# EAGLE design CycleOpsPro300toANTPlus_V2.0 (EAGLE 7.5.0)
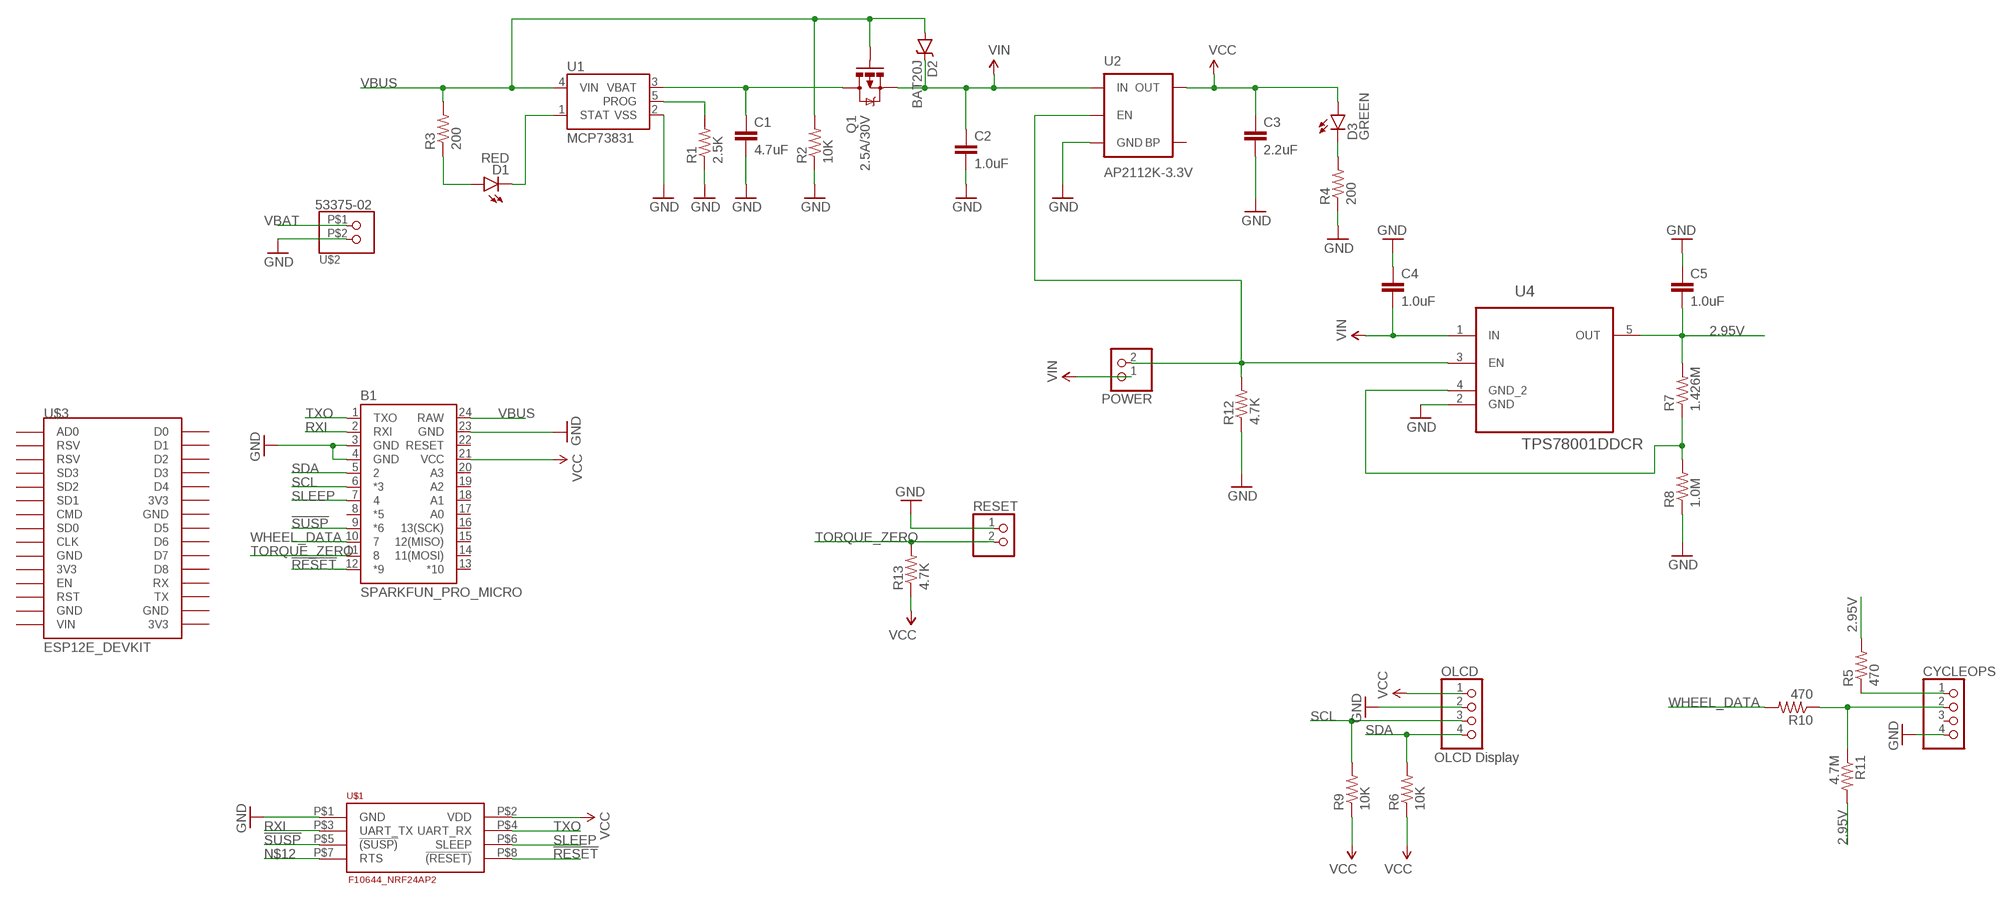
[diagram p0: schematic, sheet 1]

## Parts
B1  SPARKFUN_PRO_MICRO  [SPARKFUN_PRO_MICRO]
C1  4.7uF  CAP0603-CAP  [0603-CAP]
C2  1.0uF  CAP0603-CAP  [0603-CAP]
C3  2.2uF  CAP0603-CAP  [0603-CAP]
C4  1.0uF  CAP0603-CAP  [0603-CAP]
C5  1.0uF  CAP0603-CAP  [0603-CAP]
CYCLEOPS  PINHD-1X4  [1X04]
D1  RED  LED0603  [LED-0603]
D2  BAT20J  DIODE-SCHOTTKY-BAT20J  [SOD-323]
D3  GREEN  LED0603  [LED-0603]
OLCD  PINHD-1X4  [1X04]
POWER  PINHD-1X2  [1X02]
Q1  2.5A/30V  MOSFET-PCHANNELDMG2307L  [SOT23-3]
R1  2.5K  RESISTOR0603-RES  [0603-RES]
R2  10K  RESISTOR0603-RES  [0603-RES]
R3  200  RESISTOR0603-RES  [0603-RES]
R4  200  RESISTOR0603-RES  [0603-RES]
R5  470  RESISTOR0603-RES  [0603-RES]
R6  10K  RESISTOR0603-RES  [0603-RES]
R7  1.426M  RESISTOR0603-RES  [0603-RES]
R8  1.0M  RESISTOR0603-RES  [0603-RES]
R9  10K  RESISTOR0603-RES  [0603-RES]
R10  470  RESISTOR0603-RES  [0603-RES]
R11  4.7M  RESISTOR0603-RES  [0603-RES]
R12  4.7K  RESISTOR0603-RES  [0603-RES]
R13  4.7K  RESISTOR0603-RES  [0603-RES]
RESET  PINHD-1X2  [1X02]
U1  MCP73831  [SOT23-5]
U2  AP2112K-3.3V  V_REG_LDOSMD  [SOT23-5]
U4  TPS78001DDCR  TPS78223DDCR  [SOT95P280X110-5N]
U$1  F10644_NRF24AP2  [F10644_NRF24AP2]
U$2  53375-02  [53375-02]
U$3  ESP12E_DEVKIT  [ESP12E_DEVKIT]

## Nets
2.95V: C5.2 R5.2 R7.2 R11.2 U4.5(OUT)
!RESET: B1.12(*9) U$1.P$8(!(RESET))
!SUSP: B1.9(*6) U$1.P$5(!(SUSP))
GND: B1.3(GND) B1.4(GND) B1.23(GND) C1.2 C2.2 C3.2 C4.1 C5.1 CYCLEOPS.4 OLCD.2 R1.1 R2.1 R4.1 R8.1 R12.1 RESET.1 U1.2(VSS) U2.2(GND) U4.2(GND) U$1.P$1(GND) U$2.P$2
N$1: D1.A R3.1
N$2: D1.C U1.1(STAT)
N$3: CYCLEOPS.1 R5.1
N$4: R1.2 U1.5(PROG)
N$5: CYCLEOPS.2 R10.1 R11.1
N$6: D3.C R4.2
N$8: POWER.2 R12.2 U2.3(EN) U4.3(EN)
N$9: R7.1 R8.2 U4.4(GND_2)
N$12: U$1.P$7(RTS)
RXI: B1.2(RXI) U$1.P$3(UART_TX)
SCL: B1.6(*3) OLCD.3 R9.2
SDA: B1.5 OLCD.4 R6.2
SLEEP: B1.7 U$1.P$6(SLEEP)
TORQUE_ZERO: B1.11 R13.2 RESET.2
TXO: B1.1(TXO) U$1.P$4(UART_RX)
VBAT: C1.1 Q1.3(D) U1.3(VBAT) U$2.P$1
VBUS: B1.24(RAW) D2.A Q1.1(G) R2.2 R3.2 U1.4(VIN)
VCC: B1.21(VCC) C3.1 D3.A OLCD.1 R6.1 R9.1 R13.1 U2.5(OUT) U$1.P$2(VDD)
VIN: C2.1 C4.2 D2.C POWER.1 Q1.2(S) U2.1(IN) U4.1(IN)
WHEEL_DATA: B1.10 R10.2
Unconnected: B1.8(*5) B1.13(*10) B1.14(11(MOSI)) B1.15(12(MISO)) B1.16(13(SCK)) B1.17(A0) B1.18(A1) B1.19(A2) B1.20(A3) B1.22(RESET) CYCLEOPS.3 U2.4(BP) U$3.3V3@0(3V3) U$3.3V3@1(3V3) U$3.3V3@2(3V3) U$3.AD0 U$3.CLK U$3.CMD U$3.D0 U$3.D1 U$3.D2 U$3.D3 U$3.D4 U$3.D5 U$3.D6 U$3.D7 U$3.D8 U$3.EN U$3.GND@0(GND) U$3.GND@1(GND) U$3.GND@2(GND) U$3.GND@3(GND) U$3.RST U$3.RSV@0(RSV) U$3.RSV@1(RSV) U$3.RX U$3.SD0 U$3.SD1 U$3.SD2 U$3.SD3 U$3.TX U$3.VIN

## Notes on the sheet
- OLCD Display

## Library data of the parts
B1 = SparkFun-Boards:SPARKFUN_PRO_MICRO: SparkFun Pro Micro Atmega32U4 compatible footprint. SparkFun Products: 3.3V/8MHz <https://www.sparkfun.com/products/12587> 5V/16MHz <https://www.sparkfun.com/products/12640>
C1-C5 = SparkFun-Passives:CAP: Capacitor Standard 0603 ceramic capacitor, and 0.1" leaded capacitor.
CYCLEOPS OLCD = pinhead:PINHD-1X4: PIN HEADER
D1 D3 = SparkFun-LED:LED: LEDs Standard schematic elements and footprints for 5mm, 3mm, 1206, and 0603 sized LEDs. 5mm - Spark Fun Electronics SKU : COM-00529 (and others)
D2 = SparkFun-DiscreteSemi:DIODE-SCHOTTKY: Schottky diodes in SFE's production catalog BAT20J 1A 23V 0.62Vf RB751 120mA 40V 0.37Vf PMEG4005EJ 0.5A 40V 0.42Vf MBRA140 1A 40V 0.5Vf B340A 3A 40V SMA; PROD_ID: DIO-11623
POWER RESET = pinhead:PINHD-1X2: PIN HEADER
Q1 = SparkFun-DiscreteSemi:MOSFET-PCHANNEL: Generic PMOSFET IRLML2244 - TRANS-11153 (SOT-23 -20V -4.3A) (1.Gate 2.Source 3.Drain) FQP27P06 - COM-10349 <http://www.sparkfun.com/products/10349> (TO-220 -60V -27A) (1.Gate 2.Source 3.Drain); PROD_ID: TRANS-11308
R1-R13 = SparkFun-Passives:RESISTOR: Resistor Basic schematic elements and footprints for 0603, 1206, and PTH resistors.
U1 = SparkFun-PowerIC:MCP73831: Miniature single cell, fully integrated Li-Ion, Li-polymer charge management controller http://ww1.microchip.com/downloads/en/DeviceDoc/20001984g.pdf IC-09995; PROD_ID: IC-09995
U2 = SparkFun-PowerIC:V_REG_LDO: Voltage Regulator LDO Standard 150mA LDO voltage regulator in SOT-23 layout. Micrel part MIC5205. BP (by-pass) pin is used to lower output noise with 470pF cap.; PROD_ID: AP2112K-3.3V
U4 = Texas Instruments_By_element14_Batch_1:TPS78223DDCR: Low-Dropout Linear Regulator; MPN: TPS78223DDCR; OC_FARNELL: -; OC_NEWARK: 45P8304; PACKAGE: TSOT-23-5; SUPPLIER: Texas Instruments
U$1 = Networking and WiFI:F10644_NRF24AP2
U$2 = Molex_Connectors:53375-02: Mouser# 538-53375-0210
U$3 = ESP12E_DEVKIT:ESP12E_DEVKIT: ESP12E DEVKIT BOARD

## Board
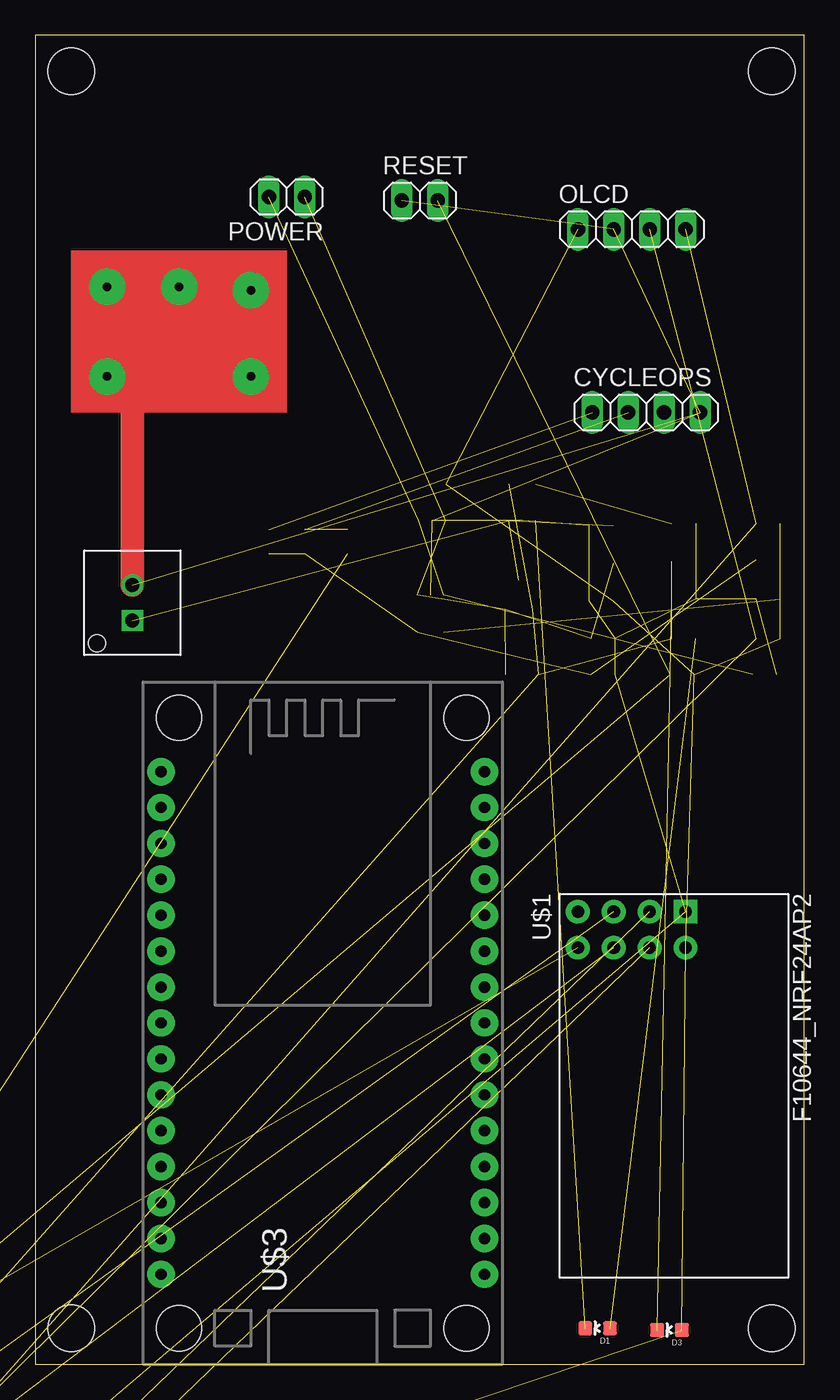
[diagram p1: board, top side]
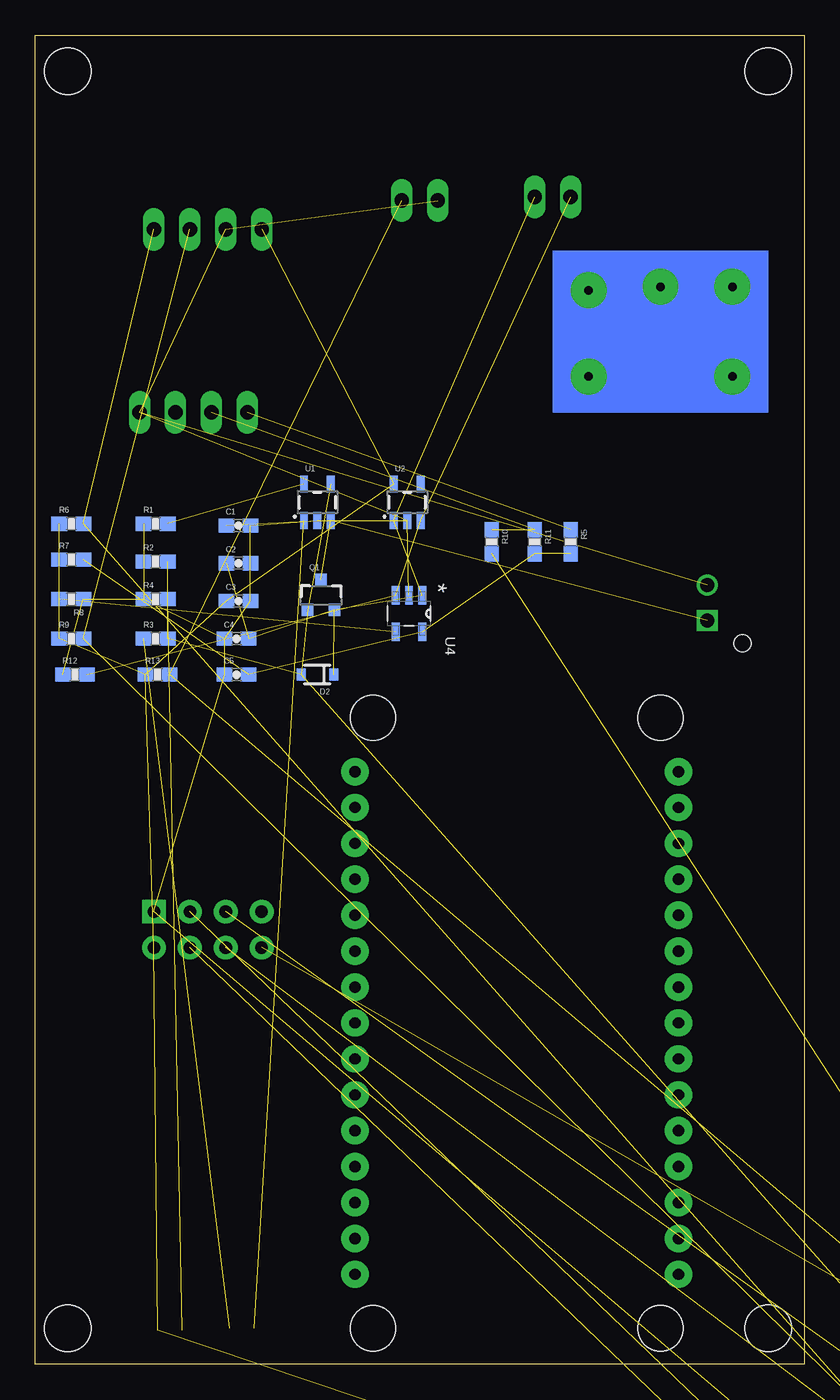
[diagram p2: board, bottom side, seen from below]

Size 54.36 x 93.98 mm. Coordinates in mm from the lower left corner, seen from the top.
Outline: 0,0 54.36,0 54.36,93.98 0,93.98 0,0
Copper layers (1*16): Top 0.035mm / dielectric 1.5mm / Bottom 0.035mm
Design rules "SeeedStudio_2layer_DRU_no_angle_20140221 *": minimum track width 8mil, minimum drill 12mil, track to track 8mil, track to pad 8mil, pad to pad 8mil, via to via 8mil, smd to smd 0mil, copper to edge 10mil, drill to drill 10mil, minimum pad ring 10mil, minimum via ring 6mil, stop-mask expansion 2mil, vias tented up to drill 100mil, thermal gap 10mil
Holes 3.3 mm at 2.54,2.54 52.07,2.54 52.07,91.44 2.54,91.44

### Footprints (pad centres in the part's own frame; a part is rotated, then mirrored left to right if it is on the bottom)
SPARKFUN_PRO_MICRO = drill 1.016 pad 1.88: 1 -7.62,12.7; 2 -7.62,10.16; 3 -7.62,7.62; 4 -7.62,5.08; 5 -7.62,2.54; 6 -7.62,0; 7 -7.62,-2.54; 8 -7.62,-5.08; 9 -7.62,-7.62; 10 -7.62,-10.16; 11 -7.62,-12.7; 12 -7.62,-15.24; 13 7.62,-15.24; 14 7.62,-12.7; 15 7.62,-10.16; 16 7.62,-7.62; 17 7.62,-5.08; 18 7.62,-2.54; 19 7.62,0; 20 7.62,2.54; 21 7.62,5.08; 22 7.62,7.62; 23 7.62,10.16; 24 7.62,12.7
0603-CAP = smd 1.1 x 1: 1 -0.85,0; 2 0.85,0
1X04 = drill 1.016 long: 1 -3.81,0; 2 -1.27,0; 3 1.27,0; 4 3.81,0
LED-0603 = smd 1 x 1: A 0,-0.877; C 0,0.877
SOD-323 = smd 0.63 x 0.83: A 1.15,0; C -1.15,0
1X02 = drill 1.016 long: 1 -1.27,0; 2 1.27,0
SOT23-3 = smd 0.8 x 0.9: 1 -0.95,-1; 2 0.95,-1; 3 0,1.1
0603-RES = smd 1.1 x 1: 1 -0.85,0; 2 0.85,0
SOT23-5 = smd 0.55 x 1.2: 1 -0.95,-1.3; 2 0,-1.3; 3 0.95,-1.3; 4 0.95,1.3; 5 -0.95,1.3
SOT95P280X110-5N = smd 1.321 x 0.559: 1 -1.295,0.94; 2 -1.295,0; 3 -1.295,-0.94; 4 1.295,-0.94; 5 1.295,0.94
F10644_NRF24AP2 = drill 0.889 pad 1.676 square: P$1 -1.27,3.81 | drill 0.889 pad 1.676: P$2 1.27,3.81; P$3 -1.27,1.27; P$4 1.27,1.27; P$5 -1.27,-1.27; P$6 1.27,-1.27; P$7 -1.27,-3.81; P$8 1.27,-3.81
53375-02 = drill 1 square: P$1 1.25,0 | drill 1: P$2 -1.25,0 | hole 1.2: 2.85,-2.5
ESP12E_DEVKIT = drill 0.8 pad 1.93: 3V3@0 -11.43,-7.62; 3V3@1 11.43,5.08; 3V3@2 11.43,-17.78; AD0 -11.43,17.78; CLK -11.43,-2.54; CMD -11.43,2.54; D0 11.43,17.78; D1 11.43,15.24; D2 11.43,12.7; D3 11.43,10.16; D4 11.43,7.62; D5 11.43,0; D6 11.43,-2.54; D7 11.43,-5.08; D8 11.43,-7.62; EN -11.43,-10.16; GND@0 -11.43,-5.08; GND@1 -11.43,-15.24; GND@2 11.43,2.54; GND@3 11.43,-15.24; RST -11.43,-12.7; RSV@0 -11.43,15.24; RSV@1 -11.43,12.7; RX 11.43,-10.16; SD0 -11.43,0; SD1 -11.43,5.08; SD2 -11.43,7.62; SD3 -11.43,10.16; TX 11.43,-12.7; VIN -11.43,-17.78 | hole 3.2: -10.16,21.59; 10.16,21.59; 10.16,-21.59; -10.16,-21.59

### Placement (x,y rotation side)
B1  -29.21,-20.32 180 top  (outside the outline)
C1  40.01,59.31 0 bottom
C2  40.01,56.64 0 bottom
C3  40.01,53.98 0 bottom
C4  40.13,51.31 0 bottom
C5  40.13,48.77 0 bottom
CYCLEOPS  43.18,67.31 0 top
D1  39.75,2.54 90 top
D2  34.42,48.77 180 bottom
D3  44.83,2.41 90 top
OLCD  42.16,80.26 0 top
POWER  17.78,82.55 180 top
Q1  34.16,54.36 0 bottom
R1  45.85,59.44 0 bottom
R2  45.85,56.77 0 bottom
R3  45.85,51.31 0 bottom
R4  45.85,54.1 0 bottom
R5  16.51,58.17 270 bottom
R6  51.82,59.44 0 bottom
R7  51.82,56.9 0 bottom
R8  51.82,54.1 180 bottom
R9  51.82,51.31 0 bottom
R10  22.1,58.17 270 bottom
R11  19.05,58.17 270 bottom
R12  51.56,48.77 0 bottom
R13  45.72,48.77 0 bottom
RESET  27.18,82.3 0 top
U1  34.42,60.96 0 bottom
U2  28.07,60.96 0 bottom
U4  27.94,53.09 270 bottom
U$1  42.16,30.73 270 top
U$2  6.86,53.85 270 top
U$3  20.32,24.13 0 top

### Tracks (layer width: path | path; a pad name or v marks a point on that pad's centre or on a via)
2.95V  (4 unrouted)
!RESET  (1 unrouted)
!SUSP  (1 unrouted)
GND  (20 unrouted)
N$1  (1 unrouted)
N$2  (1 unrouted)
N$3  (1 unrouted)
N$4  (1 unrouted)
N$5  (2 unrouted)
N$6  (1 unrouted)
N$7
  Top 1.676: 6.86,55.12 6.86,69.09
N$8  (3 unrouted)
N$9  (2 unrouted)
N$10  (via drill 0.6 pad 2.54)
  other vias: 5.08,76.2
N$11  (via drill 0.6 pad 2.54)
  other vias: 15.24,75.95
N$13  (via drill 0.6 pad 2.54)
  other vias: 15.24,69.85
N$14  (via drill 0.6 pad 2.54)
  other vias: 5.08,69.85
N$15  (via drill 0.6 pad 2.54)
  other vias: 10.16,76.2
RXI  (1 unrouted)
SCL  (2 unrouted)
SDA  (2 unrouted)
SLEEP  (1 unrouted)
TORQUE_ZERO  (2 unrouted)
TXO  (1 unrouted)
VBAT  (3 unrouted)
VBUS  (5 unrouted)
VCC  (8 unrouted)
VIN  (6 unrouted)
WHEEL_DATA  (1 unrouted)
(copper drawn outside any net)
  shapes: Bottom area x1, Top area x1

### Text on the board
tDocu: CYCLEOPS PRO 300PT TO ANT+ | V1.0 2017-02 | GND | VCC | GND | SCL | SDA | 2.95V | GND | GND | BAT+ | WHEEL_DATA